# EAGLE schematic 8x8_stm32 (EAGLE 7.3.0)
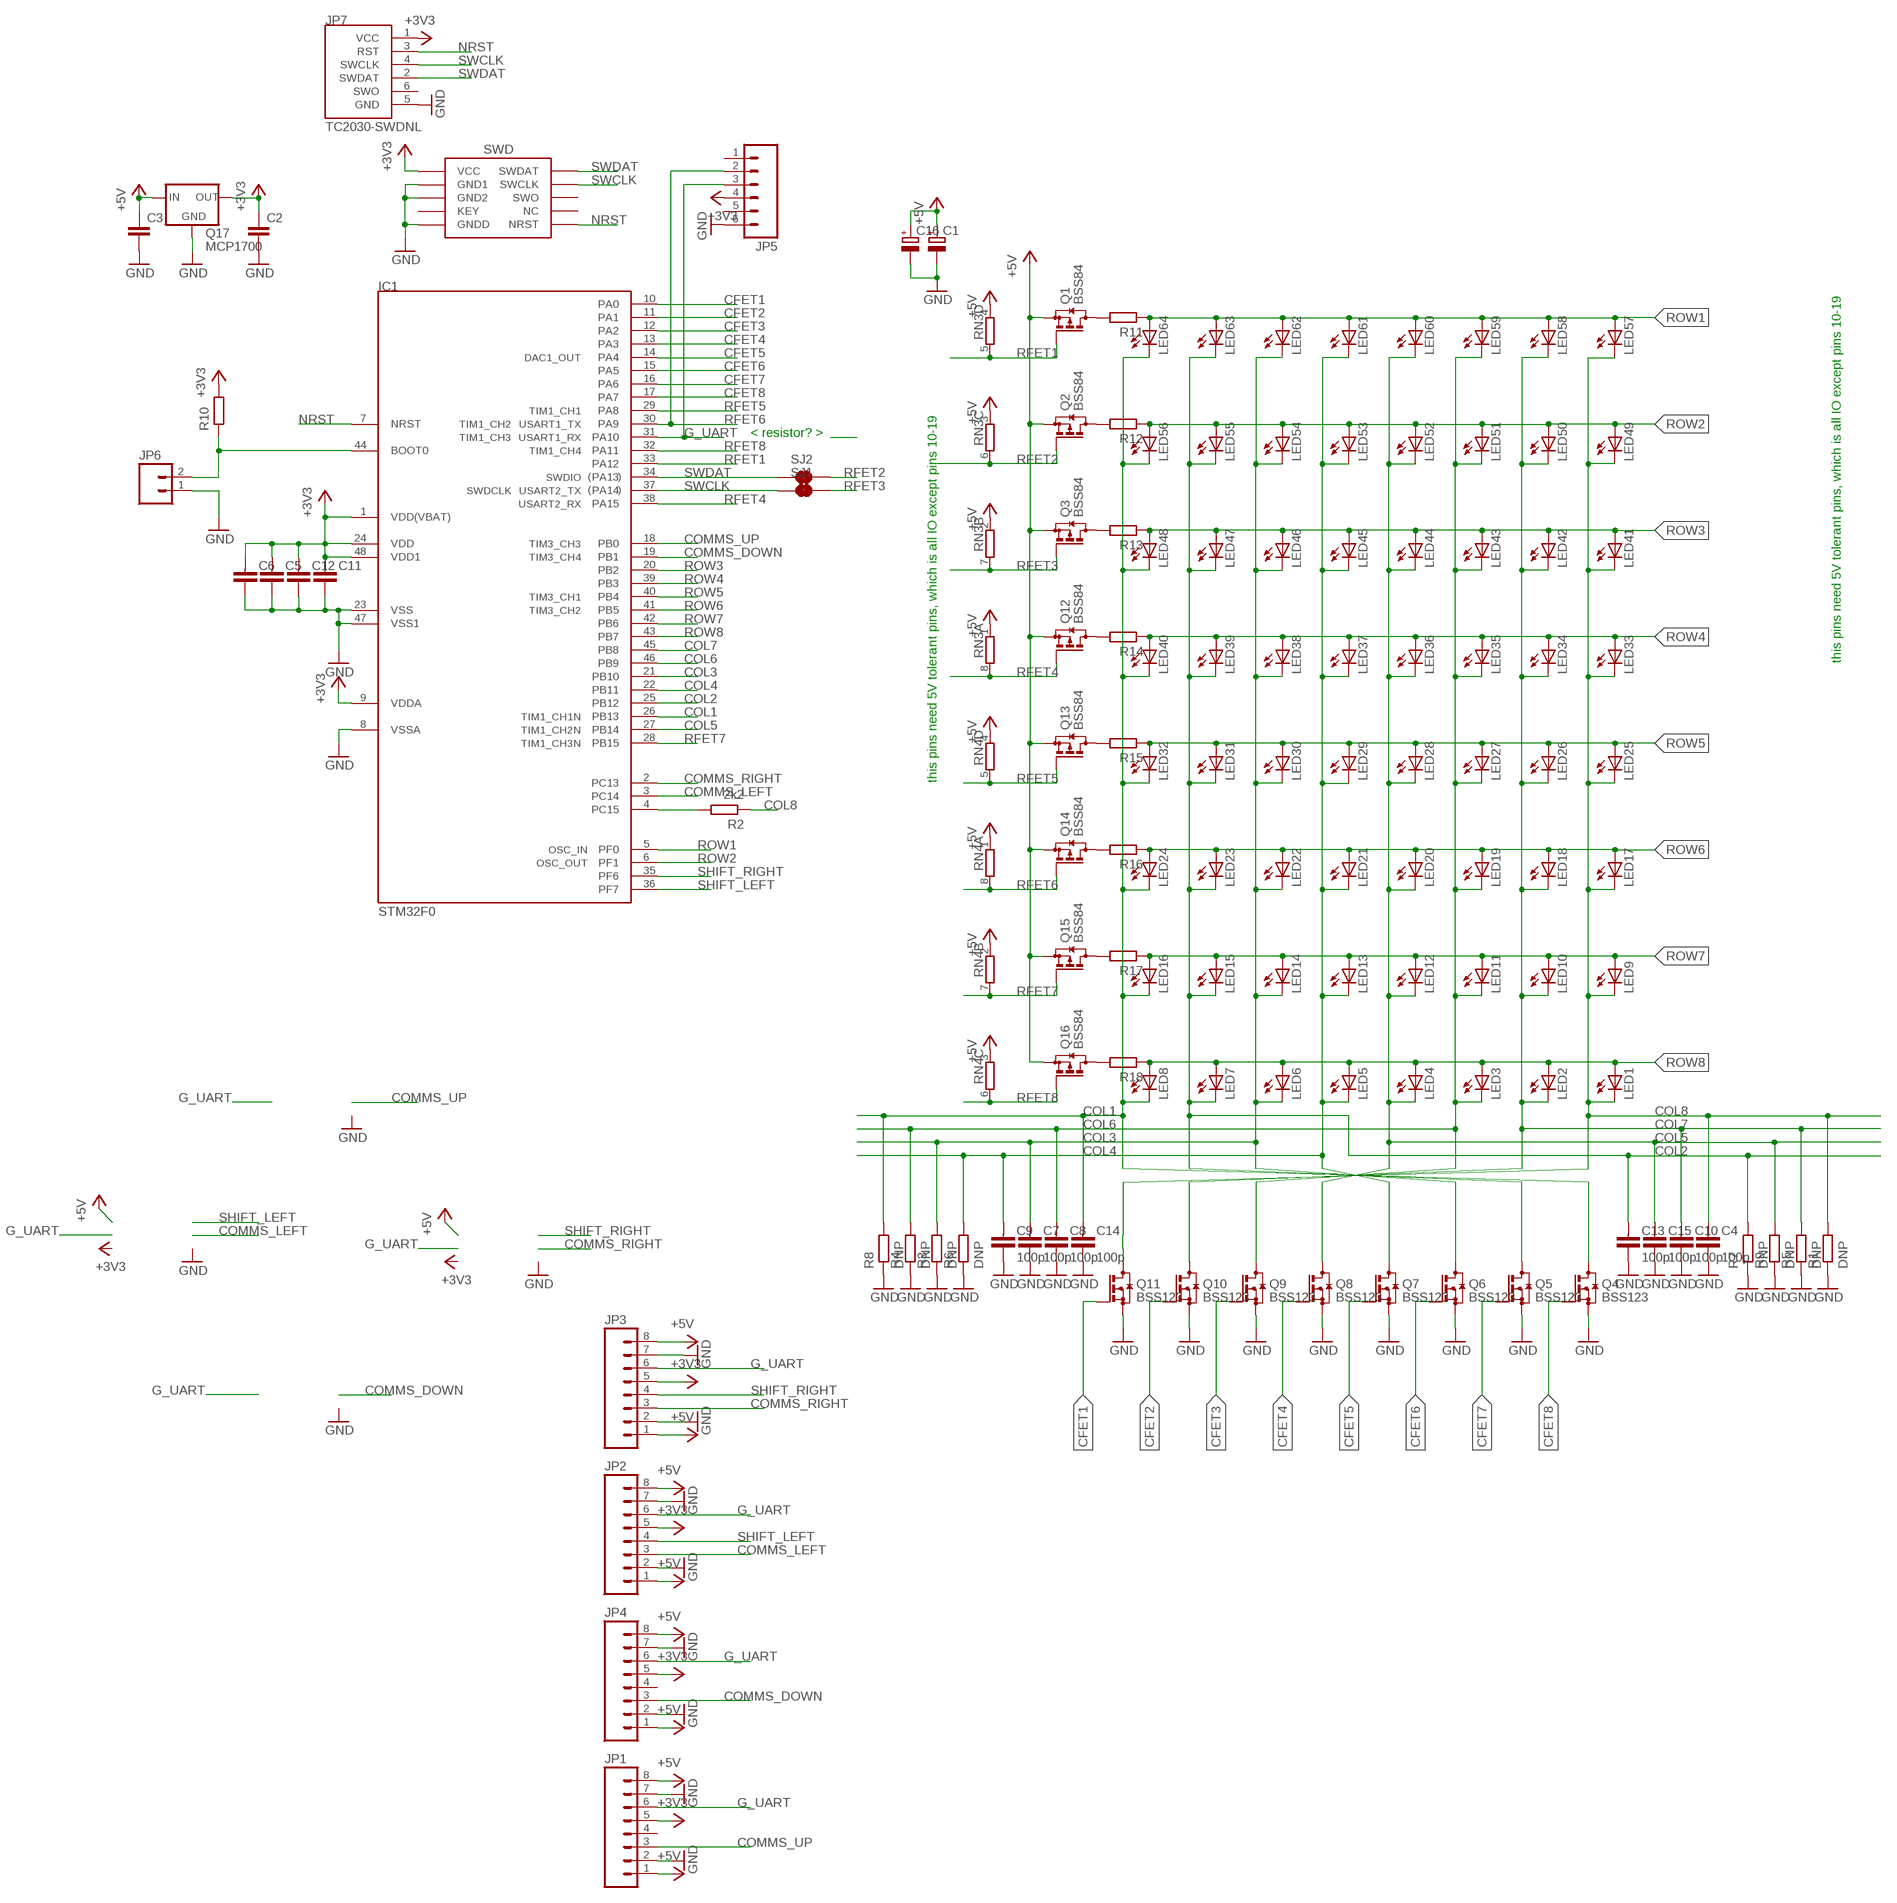
[diagram p0: schematic, sheet 1]

## Parts
C1  CPOL-EUE2-4  [E2-4]
C2  C-EU050-025X075  [C050-025X075]
C3  C-EU050-025X075  [C050-025X075]
C4  100p  CAPACITOR0603-N  [C0603-N]
C5  CAPACITOR0603-N  [C0603-N]
C6  CAPACITOR0603-N  [C0603-N]
C7  100p  CAPACITOR0603-N  [C0603-N]
C8  100p  CAPACITOR0603-N  [C0603-N]
C9  100p  CAPACITOR0603-N  [C0603-N]
C10  100p  CAPACITOR0603-N  [C0603-N]
C11  CAPACITOR0603-N  [C0603-N]
C12  CAPACITOR0603-N  [C0603-N]
C13  100p  CAPACITOR0603-N  [C0603-N]
C14  100p  CAPACITOR0603-N  [C0603-N]
C15  100p  CAPACITOR0603-N  [C0603-N]
C16  CPOL-EUE2-4  [E2-4]
IC1  STM32F0  [TQFP48]
J1  SWD_SHROUD  [SWD_PTH_SHROUD]
JP1  M08  [1X08_ROUND]
JP2  M08  [1X08_ROUND]
JP3  M08  [1X08_ROUND]
JP4  M08  [1X08_ROUND]
JP5  M06SILK_FEMALE_PTH  [1X06]
JP6  M02PTH  [1X02]
JP7  TC2030-SWDNL  [TC2030-MCP-NL]
LED1  LED5MM/0603  [LED5MM/SMD]
LED2  LED5MM/0603  [LED5MM/SMD]
LED3  LED5MM/0603  [LED5MM/SMD]
LED4  LED5MM/0603  [LED5MM/SMD]
LED5  LED5MM/0603  [LED5MM/SMD]
LED6  LED5MM/0603  [LED5MM/SMD]
LED7  LED5MM/0603  [LED5MM/SMD]
LED8  LED5MM/0603  [LED5MM/SMD]
LED9  LED5MM/0603  [LED5MM/SMD]
LED10  LED5MM/0603  [LED5MM/SMD]
LED11  LED5MM/0603  [LED5MM/SMD]
LED12  LED5MM/0603  [LED5MM/SMD]
LED13  LED5MM/0603  [LED5MM/SMD]
LED14  LED5MM/0603  [LED5MM/SMD]
LED15  LED5MM/0603  [LED5MM/SMD]
LED16  LED5MM/0603  [LED5MM/SMD]
LED17  LED5MM/0603  [LED5MM/SMD]
LED18  LED5MM/0603  [LED5MM/SMD]
LED19  LED5MM/0603  [LED5MM/SMD]
LED20  LED5MM/0603  [LED5MM/SMD]
LED21  LED5MM/0603  [LED5MM/SMD]
LED22  LED5MM/0603  [LED5MM/SMD]
LED23  LED5MM/0603  [LED5MM/SMD]
LED24  LED5MM/0603  [LED5MM/SMD]
LED25  LED5MM/0603  [LED5MM/SMD]
LED26  LED5MM/0603  [LED5MM/SMD]
LED27  LED5MM/0603  [LED5MM/SMD]
LED28  LED5MM/0603  [LED5MM/SMD]
LED29  LED5MM/0603  [LED5MM/SMD]
LED30  LED5MM/0603  [LED5MM/SMD]
LED31  LED5MM/0603  [LED5MM/SMD]
LED32  LED5MM/0603  [LED5MM/SMD]
LED33  LED5MM/0603  [LED5MM/SMD]
LED34  LED5MM/0603  [LED5MM/SMD]
LED35  LED5MM/0603  [LED5MM/SMD]
LED36  LED5MM/0603  [LED5MM/SMD]
LED37  LED5MM/0603  [LED5MM/SMD]
LED38  LED5MM/0603  [LED5MM/SMD]
LED39  LED5MM/0603  [LED5MM/SMD]
LED40  LED5MM/0603  [LED5MM/SMD]
LED41  LED5MM/0603  [LED5MM/SMD]
LED42  LED5MM/0603  [LED5MM/SMD]
LED43  LED5MM/0603  [LED5MM/SMD]
LED44  LED5MM/0603  [LED5MM/SMD]
LED45  LED5MM/0603  [LED5MM/SMD]
LED46  LED5MM/0603  [LED5MM/SMD]
LED47  LED5MM/0603  [LED5MM/SMD]
LED48  LED5MM/0603  [LED5MM/SMD]
LED49  LED5MM/0603  [LED5MM/SMD]
LED50  LED5MM/0603  [LED5MM/SMD]
LED51  LED5MM/0603  [LED5MM/SMD]
LED52  LED5MM/0603  [LED5MM/SMD]
LED53  LED5MM/0603  [LED5MM/SMD]
LED54  LED5MM/0603  [LED5MM/SMD]
LED55  LED5MM/0603  [LED5MM/SMD]
LED56  LED5MM/0603  [LED5MM/SMD]
LED57  LED5MM/0603  [LED5MM/SMD]
LED58  LED5MM/0603  [LED5MM/SMD]
LED59  LED5MM/0603  [LED5MM/SMD]
LED60  LED5MM/0603  [LED5MM/SMD]
LED61  LED5MM/0603  [LED5MM/SMD]
LED62  LED5MM/0603  [LED5MM/SMD]
LED63  LED5MM/0603  [LED5MM/SMD]
LED64  LED5MM/0603  [LED5MM/SMD]
Q1  BSS84  [SOT23]
Q2  BSS84  [SOT23]
Q3  BSS84  [SOT23]
Q4  BSS123  [SOT23]
Q5  BSS123  [SOT23]
Q6  BSS123  [SOT23]
Q7  BSS123  [SOT23]
Q8  BSS123  [SOT23]
Q9  BSS123  [SOT23]
Q10  BSS123  [SOT23]
Q11  BSS123  [SOT23]
Q12  BSS84  [SOT23]
Q13  BSS84  [SOT23]
Q14  BSS84  [SOT23]
Q15  BSS84  [SOT23]
Q16  BSS84  [SOT23]
Q17  MCP1700  [TO92-INLINE]
R1  DNP  RESISTOR0603-N  [R0603-N]
R2  2k2  RESISTOR0603-N  [R0603-N]
R3  DNP  RESISTOR0603-N  [R0603-N]
R4  DNP  RESISTOR0603-N  [R0603-N]
R5  DNP  RESISTOR0603-N  [R0603-N]
R6  DNP  RESISTOR0603-N  [R0603-N]
R7  DNP  RESISTOR0603-N  [R0603-N]
R8  DNP  RESISTOR0603-N  [R0603-N]
R9  DNP  RESISTOR0603-N  [R0603-N]
R10  RESISTOR0603-N  [R0603-N]
R11  RESISTOR0603-N  [R0603-N]
R12  RESISTOR0603-N  [R0603-N]
R13  RESISTOR0603-N  [R0603-N]
R14  RESISTOR0603-N  [R0603-N]
R15  RESISTOR0603-N  [R0603-N]
R16  RESISTOR0603-N  [R0603-N]
R17  RESISTOR0603-N  [R0603-N]
R18  RESISTOR0603-N  [R0603-N]
RN3  4R-NEXB38V  [EXB38V]
RN4  4R-NEXB38V  [EXB38V]
SJ1  JUMPER-PAD-2-NC_BY_TRACE  [PAD-JUMPER-2-NC_BY_TRACE_YES_SILK]
SJ2  JUMPER-PAD-2-NC_BY_TRACE  [PAD-JUMPER-2-NC_BY_TRACE_YES_SILK]

## Nets
+3V3: C2.1 C5.1 C6.1 C11.1 C12.1 IC1.1(VDD(VBAT)) IC1.9(VDDA) IC1.24(VDD) IC1.48(VDD1) J1.1(VCC) JP1.5 JP2.5 JP3.5 JP4.5 JP5.4 JP7.1(VCC) Q17.VOUT(OUT) R10.2
+5V: C1.+ C3.1 C16.+ JP1.1 JP1.8 JP2.1 JP2.8 JP3.1 JP3.8 JP4.1 JP4.8 Q1.2(S) Q2.2(S) Q3.2(S) Q12.2(S) Q13.2(S) Q14.2(S) Q15.2(S) Q16.2(S) Q17.VIN(IN) RN3.1 RN3.2 RN3.3 RN3.4 RN4.1 RN4.2 RN4.3 RN4.4
CFET1: IC1.10(PA0) Q11.1(G)
CFET2: IC1.11(PA1) Q10.1(G)
CFET3: IC1.12(PA2) Q9.1(G)
CFET4: IC1.13(PA3) Q8.1(G)
CFET5: IC1.14(PA4) Q7.1(G)
CFET6: IC1.15(PA5) Q6.1(G)
CFET7: IC1.16(PA6) Q5.1(G)
CFET8: IC1.17(PA7) Q4.1(G)
COL1: C14.1 IC1.26(PB13) LED8.K1(C) LED8.K(C) LED16.K1(C) LED16.K(C) LED24.K1(C) LED24.K(C) LED32.K1(C) LED32.K(C) LED40.K1(C) LED40.K(C) LED48.K1(C) LED48.K(C) LED56.K1(C) LED56.K(C) LED64.K1(C) LED64.K(C) Q4.3(D) R8.2
COL2: C13.1 IC1.25(PB12) LED7.K1(C) LED7.K(C) LED15.K1(C) LED15.K(C) LED23.K1(C) LED23.K(C) LED31.K1(C) LED31.K(C) LED39.K1(C) LED39.K(C) LED47.K1(C) LED47.K(C) LED55.K1(C) LED55.K(C) LED63.K1(C) LED63.K(C) Q5.3(D) R7.2
COL3: C7.1 IC1.21(PB10) LED6.K1(C) LED6.K(C) LED14.K1(C) LED14.K(C) LED22.K1(C) LED22.K(C) LED30.K1(C) LED30.K(C) LED38.K1(C) LED38.K(C) LED46.K1(C) LED46.K(C) LED54.K1(C) LED54.K(C) LED62.K1(C) LED62.K(C) Q6.3(D) R3.2
COL4: C9.1 IC1.22(PB11) LED5.K1(C) LED5.K(C) LED13.K1(C) LED13.K(C) LED21.K1(C) LED21.K(C) LED29.K1(C) LED29.K(C) LED37.K1(C) LED37.K(C) LED45.K1(C) LED45.K(C) LED53.K1(C) LED53.K(C) LED61.K1(C) LED61.K(C) Q7.3(D) R6.2
COL5: C15.1 IC1.27(PB14) LED4.K1(C) LED4.K(C) LED12.K1(C) LED12.K(C) LED20.K1(C) LED20.K(C) LED28.K1(C) LED28.K(C) LED36.K1(C) LED36.K(C) LED44.K1(C) LED44.K(C) LED52.K1(C) LED52.K(C) LED60.K1(C) LED60.K(C) Q8.3(D) R9.2
COL6: C8.1 IC1.46(PB9) LED3.K1(C) LED3.K(C) LED11.K1(C) LED11.K(C) LED19.K1(C) LED19.K(C) LED27.K1(C) LED27.K(C) LED35.K1(C) LED35.K(C) LED43.K1(C) LED43.K(C) LED51.K1(C) LED51.K(C) LED59.K1(C) LED59.K(C) Q9.3(D) R4.2
COL7: C10.1 IC1.45(PB8) LED2.K1(C) LED2.K(C) LED10.K1(C) LED10.K(C) LED18.K1(C) LED18.K(C) LED26.K1(C) LED26.K(C) LED34.K1(C) LED34.K(C) LED42.K1(C) LED42.K(C) LED50.K1(C) LED50.K(C) LED58.K1(C) LED58.K(C) Q10.3(D) R5.2
COL8: C4.1 LED1.K1(C) LED1.K(C) LED9.K1(C) LED9.K(C) LED17.K1(C) LED17.K(C) LED25.K1(C) LED25.K(C) LED33.K1(C) LED33.K(C) LED41.K1(C) LED41.K(C) LED49.K1(C) LED49.K(C) LED57.K1(C) LED57.K(C) Q11.3(D) R1.2 R2.1
COMMS_DOWN: IC1.19(PB1) JP4.3
COMMS_LEFT: IC1.3(PC14) JP2.3
COMMS_RIGHT: IC1.2(PC13) JP3.3
COMMS_UP: IC1.18(PB0) JP1.3
G_UART: IC1.31(PA10) JP1.6 JP2.6 JP3.6 JP4.6 JP5.3
GND: C1.- C2.2 C3.2 C4.2 C5.2 C6.2 C7.2 C8.2 C9.2 C10.2 C11.2 C12.2 C13.2 C14.2 C15.2 C16.- IC1.8(VSSA) IC1.23(VSS) IC1.47(VSS1) J1.3(GND1) J1.5(GND2) J1.9(GNDD) JP1.2 JP1.7 JP2.2 JP2.7 JP3.2 JP3.7 JP4.2 JP4.7 JP5.6 JP6.1 JP7.5(GND) Q4.2(S) Q5.2(S) Q6.2(S) Q7.2(S) Q8.2(S) Q9.2(S) Q10.2(S) Q11.2(S) Q17.GND R1.1 R3.1 R4.1 R5.1 R6.1 R7.1 R8.1 R9.1
N$9: IC1.44(BOOT0) JP6.2 R10.1
N$11: IC1.4(PC15) R2.2
N$12: Q1.3(D) R11.2
N$13: Q2.3(D) R12.2
N$14: Q3.3(D) R13.2
N$15: Q12.3(D) R14.2
N$16: Q13.3(D) R15.2
N$17: Q14.3(D) R16.2
N$18: Q15.3(D) R17.2
N$19: Q16.3(D) R18.2
NRST: IC1.7(NRST) J1.10(NRST) JP7.3(RST)
RFET1: IC1.33(PA12) Q1.1(G) RN3.5
RFET2: Q2.1(G) RN3.6 SJ2.2
RFET3: Q3.1(G) RN3.7 SJ1.2
RFET4: IC1.38(PA15) Q12.1(G) RN3.8
RFET5: IC1.29(PA8) Q13.1(G) RN4.5
RFET6: IC1.30(PA9) JP5.2 Q14.1(G) RN4.8
RFET7: IC1.28(PB15) Q15.1(G) RN4.7
RFET8: IC1.32(PA11) Q16.1(G) RN4.6
ROW1: IC1.5(PF0) LED57.A LED57.A1(A) LED58.A LED58.A1(A) LED59.A LED59.A1(A) LED60.A LED60.A1(A) LED61.A LED61.A1(A) LED62.A LED62.A1(A) LED63.A LED63.A1(A) LED64.A LED64.A1(A) R11.1
ROW2: IC1.6(PF1) LED49.A LED49.A1(A) LED50.A LED50.A1(A) LED51.A LED51.A1(A) LED52.A LED52.A1(A) LED53.A LED53.A1(A) LED54.A LED54.A1(A) LED55.A LED55.A1(A) LED56.A LED56.A1(A) R12.1
ROW3: IC1.20(PB2) LED41.A LED41.A1(A) LED42.A LED42.A1(A) LED43.A LED43.A1(A) LED44.A LED44.A1(A) LED45.A LED45.A1(A) LED46.A LED46.A1(A) LED47.A LED47.A1(A) LED48.A LED48.A1(A) R13.1
ROW4: IC1.39(PB3) LED33.A LED33.A1(A) LED34.A LED34.A1(A) LED35.A LED35.A1(A) LED36.A LED36.A1(A) LED37.A LED37.A1(A) LED38.A LED38.A1(A) LED39.A LED39.A1(A) LED40.A LED40.A1(A) R14.1
ROW5: IC1.40(PB4) LED25.A LED25.A1(A) LED26.A LED26.A1(A) LED27.A LED27.A1(A) LED28.A LED28.A1(A) LED29.A LED29.A1(A) LED30.A LED30.A1(A) LED31.A LED31.A1(A) LED32.A LED32.A1(A) R15.1
ROW6: IC1.41(PB5) LED17.A LED17.A1(A) LED18.A LED18.A1(A) LED19.A LED19.A1(A) LED20.A LED20.A1(A) LED21.A LED21.A1(A) LED22.A LED22.A1(A) LED23.A LED23.A1(A) LED24.A LED24.A1(A) R16.1
ROW7: IC1.42(PB6) LED9.A LED9.A1(A) LED10.A LED10.A1(A) LED11.A LED11.A1(A) LED12.A LED12.A1(A) LED13.A LED13.A1(A) LED14.A LED14.A1(A) LED15.A LED15.A1(A) LED16.A LED16.A1(A) R17.1
ROW8: IC1.43(PB7) LED1.A LED1.A1(A) LED2.A LED2.A1(A) LED3.A LED3.A1(A) LED4.A LED4.A1(A) LED5.A LED5.A1(A) LED6.A LED6.A1(A) LED7.A LED7.A1(A) LED8.A LED8.A1(A) R18.1
SHIFT_LEFT: IC1.36(PF7) JP2.4
SHIFT_RIGHT: IC1.35(PF6) JP3.4
SWCLK: IC1.37(PA14) J1.4(SWCLK) JP7.4(SWCLK) SJ1.1
SWDAT: IC1.34(PA13) J1.2(SWDAT) JP7.2(SWDAT) SJ2.1
Unconnected: J1.6(SWO) J1.7(KEY) J1.8(NC) JP1.4 JP4.4 JP5.1 JP5.5 JP7.6(SWO)

## Notes on the sheet
- < resistor? >
- this pins need 5V tolerant pins, which is all IO except pins 10-19
- this pins need 5V tolerant pins, which is all IO except pins 10-19

## Library data of the parts
C1 C16 = rcl:CPOL-EU: POLARIZED CAPACITOR, European symbol
C2 C3 = rcl:C-EU: CAPACITOR, European symbol
C4-C15 = passives-7351:CAPACITOR
IC1 = Mine:STM32F0
J1 = dtb:SWD_SHROUD
JP1-JP4 = SparkFun-Connectors:M08: Header 8 Standard 8-pin 0.1" header. Use with straight break away headers (SKU : PRT-00116), right angle break away headers (PRT-00553), swiss pins (PRT-00743), machine pins (PRT-00117), and female headers (PRT-00115).
JP5 = SparkFun-Connectors:M06: Header 6 Standard 6-pin 0.1" header. Use with straight break away headers (SKU : PRT-00116), right angle break away headers (PRT-00553), swiss pins (PRT-00743), machine pins (PRT-00117), and female headers (PRT-00115). Molex polarized connector foot print use with SKU : PRT-08094 with associated crimp pins and housings. NOTES ON THE VARIANTS LOCK and LOCK_LONGPADS... This footprint was designed to help hold the alignment of a through-hole component (i.e. 6-pin header) while soldering it into place. You may notice that each hole has been shifted either up or down by 0.005 of an inch from it's more standard position (which is a perfectly straight line). This slight alteration caused the pins (the squares in the middle) to touch the edges of the holes. Because they are alternating, it causes a "brace" to hold the component in place. 0.005 has proven to be the perfect amount of "off-center" position when using our standard breakaway headers. Although looks a little odd when you look at the bare footprint, once you have a header in there, the alteration is very hard to notice. Also,if you push a header all the way into place, it is covered up entirely on the bottom side. This idea of altering the position of holes to aid alignment will be further integrated into the Sparkfun Library for other footprints. It can help hold any component with 3 or more connection pins.; PROD_ID: CONN-08437
JP6 = Mine:M02: Header 2 Standard 2-pin 0.1" header. Use with straight break away headers (SKU : PRT-00116), right angle break away headers (PRT-00553), swiss pins (PRT-00743), machine pins (PRT-00117), and female headers (PRT-00115). Molex polarized connector foot print use with SKU : PRT-08233 with associated crimp pins and housings.
JP7 = tag-connect:TC2030-SWD
LED1-LED64 = dtb:LED: LED OSRAM: - CHIPLED LG R971, LG N971, LY N971, LG Q971, LY Q971, LO R971, LY R971 LH N974, LH R974 LS Q976, LO Q976, LY Q976 LO Q996 - Hyper CHIPLED LW Q18S LB Q993, LB Q99A, LB R99A - SideLED LS A670, LO A670, LY A670, LG A670, LP A670 LB A673, LV A673, LT A673, LW A673 LH A674 LY A675 LS A676, LA A676, LO A676, LY A676, LW A676 LS A679, LY A679, LG A679 - Hyper Micro SIDELED® LS Y876, LA Y876, LO Y876, LY Y876 LT Y87S - SmartLED LW L88C, LW L88S LB L89C, LB L89S, LG L890 LS L89K, LO L89K, LY L89K LS L896, LA L896, LO L896, LY L896 - TOPLED LS T670, LO T670, LY T670, LG T670, LP T670 LSG T670, LSP T670, LSY T670, LOP T670, LYG T670 LG T671, LOG T671, LSG T671 LB T673, LV T673, LT T673, LW T673 LH T674 LS T676, LA T676, LO T676, LY T676, LB T676, LH T676, LSB T676, LW T676 LB T67C, LV T67C, LT T67C, LS T67K, LO T67K, LY T67K, LW E67C LS E67B, LA E67B, LO E67B, LY E67B, LB E67C, LV E67C, LT E67C LW T67C LS T679, LY T679, LG T679 LS T770, LO T770, LY T770, LG T770, LP T770 LB T773, LV T773, LT T773, LW T773 LH T774 LS E675, LA E675, LY E675, LS T675 LS T776, LA T776, LO T776, LY T776, LB T776 LHGB T686 LT T68C, LB T68C - Hyper Mini TOPLED® LB M676 - Mini TOPLED Santana® LG M470 LS M47K, LO M47K, LY M47K Source: http://www.osram.convergy.de LUXEON: - LUMILED® LXK2-PW12-R00, LXK2-PW12-S00, LXK2-PW14-U00, LXK2-PW14-V00 LXK2-PM12-R00, LXK2-PM12-S00, LXK2-PM14-U00 LXK2-PE12-Q00, LXK2-PE12-R00, LXK2-PE12-S00, LXK2-PE14-T00, LXK2-PE14-U00 LXK2-PB12-K00, LXK2-PB12-L00, LXK2-PB12-M00, LXK2-PB14-N00, LXK2-PB14-P00, LXK2-PB14-Q00 LXK2-PR12-L00, LXK2-PR12-M00, LXK2-PR14-Q00, LXK2-PR14-R00 LXK2-PD12-Q00, LXK2-PD12-R00, LXK2-PD12-S00 LXK2-PH12-R00, LXK2-PH12-S00 LXK2-PL12-P00, LXK2-PL12-Q00, LXK2-PL12-R00 Source: www.luxeon.com KINGBRIGHT: KA-3528ASYC Source: www.kingbright.com
Q1-Q3 Q12-Q16 = transistor-small-signal:BSS84: P-CHANNEL MOS FET
Q4-Q11 = transistor-small-signal:BSS123: N-CHANNEL MOS FET
Q17 = dtb:MCP1700
R1-R18 = passives-7351:RESISTOR
RN3 RN4 = resistor-dil:4R-N: Array Chip Resistor Source: RS Component / Phycomp; OC_FARNELL: unknown; OC_NEWARK: unknown
SJ1 SJ2 = SparkFun-Passives:JUMPER-PAD-2-NC_BY_TRACE